# Altium schematic sheet RHS_FEST22-EV_Power.SchDoc: RHS power
size A4; Engineer: Danel Tiitma; Organization: MTÜ Tudengi Vormel; Address1: Pärnu mnt 62; Address2: Tallinn; Address3: Estonia, 10135; Revision: 1; SheetNumber: 2; SheetTotal: 2
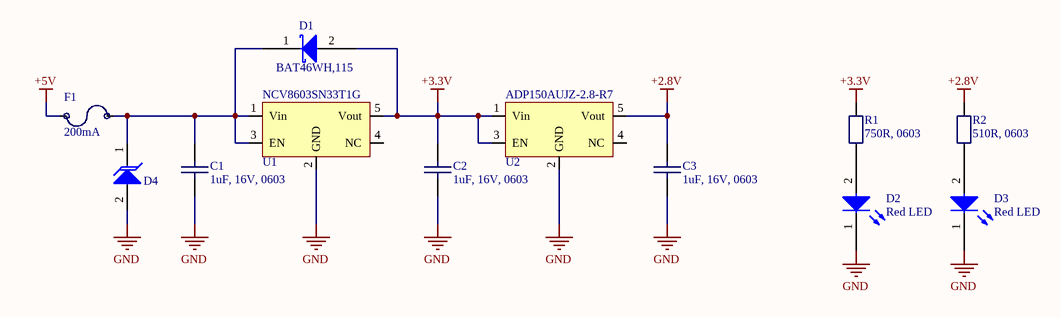
[diagram p0: RHS_FEST22-EV_Power.SchDoc]

## Parts
C1  1uF, 16V, 0603  [CAP [0603] 1608]
C2  1uF, 16V, 0603  [CAP [0603] 1608]
C3  1uF, 16V, 0603  [CAP [0603] 1608]
D1  BAT46WH,115  [SOD-123F]
D2  Red LED  [LED [0603] 1608]
D3  Red LED  [LED [0603] 1608]
D4  TV02W5V0-G  [SOD-123-2]  (value not drawn)
F1  200mA  [RES [0603] 1608]
R1  750R, 0603  [RES [0603] 1608]
R2  510R, 0603  [RES [0603] 1608]
U1  NCV8603SN33T1G  [TSOT-5]
U2  ADP150AUJZ-2.8-R7  [TSOT-5]

## Nets
+2.8V: C3.1 R2.1 U2.5(Vout)
+3.3V: C2.1 D1.2(K) R1.1 U1.5(Vout) U2.1(Vin) U2.3(EN)
+5V: F1.1
GND: C1.2 C2.2 C3.2 D2.1(A) D3.1(A) D4.2(A) U1.2(GND) U2.2(GND)
NetC1_1: C1.1 D1.1(A) D4.1(K) F1.2 U1.1(Vin) U1.3(EN)
NetD2_2: D2.2(K) R1.2
NetD3_2: D3.2(K) R2.2

Not connected (* = marked no-connect by the designer): U1 4(NC); U2 4(NC)

## Notes on the sheet
- Engineer:
- Date:
- Rev:

## Library data of the parts
C1-C3 = Cap 1uF: Manufacturer: MURATA; Order Step: 10; Product Name: GCJ188R71E105KA01D; Datasheet: https://www.farnell.com/datasheets/3158835.pdf; Notes: *; Price: 0.156; Supplier: Farnell; Supplier Number: 2781410
D1 = BAT46WH,115: Schottky diode; Manufacturer: Nexperia; Order Step: 1; Datasheet: https://www.farnell.com/datasheets/1508345.pdf; Notes: *; Price: 0.298; Product Name: BAT46WH,115; Supplier: Mouser; Supplier Number: 771-BAT46WH115
D2 D3 = Red LED: Manufacturer: KINGBRIGHT; Order Step: 5; Product Name: KPT-1608LVSECK-J3-PRV; Datasheet: http://www.farnell.com/datasheets/2068420.pdf?_ga=2.36173545.89986474.1576161266-1510626616.1539531469; Notes: *; Price: 0,419; Supplier: Farnell; Supplier Number: 2610406
D4 = TV02W5V0-G: TVS diode; Manufacturer: Comchip; Order Step: 1; Product Name: TV02W5V0-G; Supplier Number: 750-TV02W5V0-G; Datasheet: https://www.mouser.ee/datasheet/2/80/TV02W_G_series_RevE-2506525.pdf; Notes: *; Price: 0,368; Supplier: Mouser
F1 = Fuse: Manufacturer: Littlefuse; Product Name: 0467.250NR; Order Step: 10; Supplier Number: 1596942; Supplier: Farnell; Notes: *; Datasheet: https://www.farnell.com/datasheets/2282563.pdf; Price: 0.664
R1 = RES 750: Manufacturer: YAGEO; Order Step: 10; Product Name: RC0603FR-07750RL; Datasheet: https://www.farnell.com/datasheets/3046031.pdf; Notes: *; Price: 0.0289; Supplier: Farnell; Supplier Number: 3495907
R2 = Res 510: Manufacturer: YAGEO; Order Step: 10; Product Name: RC0603FR-07510RL; Datasheet: https://www.farnell.com/datasheets/3046031.pdf; Notes: *; Price: 0.0266; Supplier: Farnell; Supplier Number: 3495869
U1 = NCV8603SN33T1G: Linear voltage regulator; Manufacturer: onsemi; Order Step: 1; Product Name: NCV8603SN33T1G; Supplier Number: 863-NCV8603SN33T1G; Datasheet: https://www.mouser.ee/datasheet/2/308/1/NCV8603_D-2317642.pdf; Notes: *; Price: 0.613; Supplier: Mouser
U2 = ADP150AUJZ-2.8-R7: Linear voltage regulator; Manufacturer: Analog Devices; Order Step: 1; Product Name: ADP150AUJZ-2.8-R7; Supplier Number: 584-ADP150AUJZ-2.8R7; Datasheet: https://www.mouser.ee/datasheet/2/609/ADP150-1503284.pdf; Notes: *; Price: 0.97; Supplier: Mouser